# EAGLE design OttoPi04 (EAGLE 9.6.2)
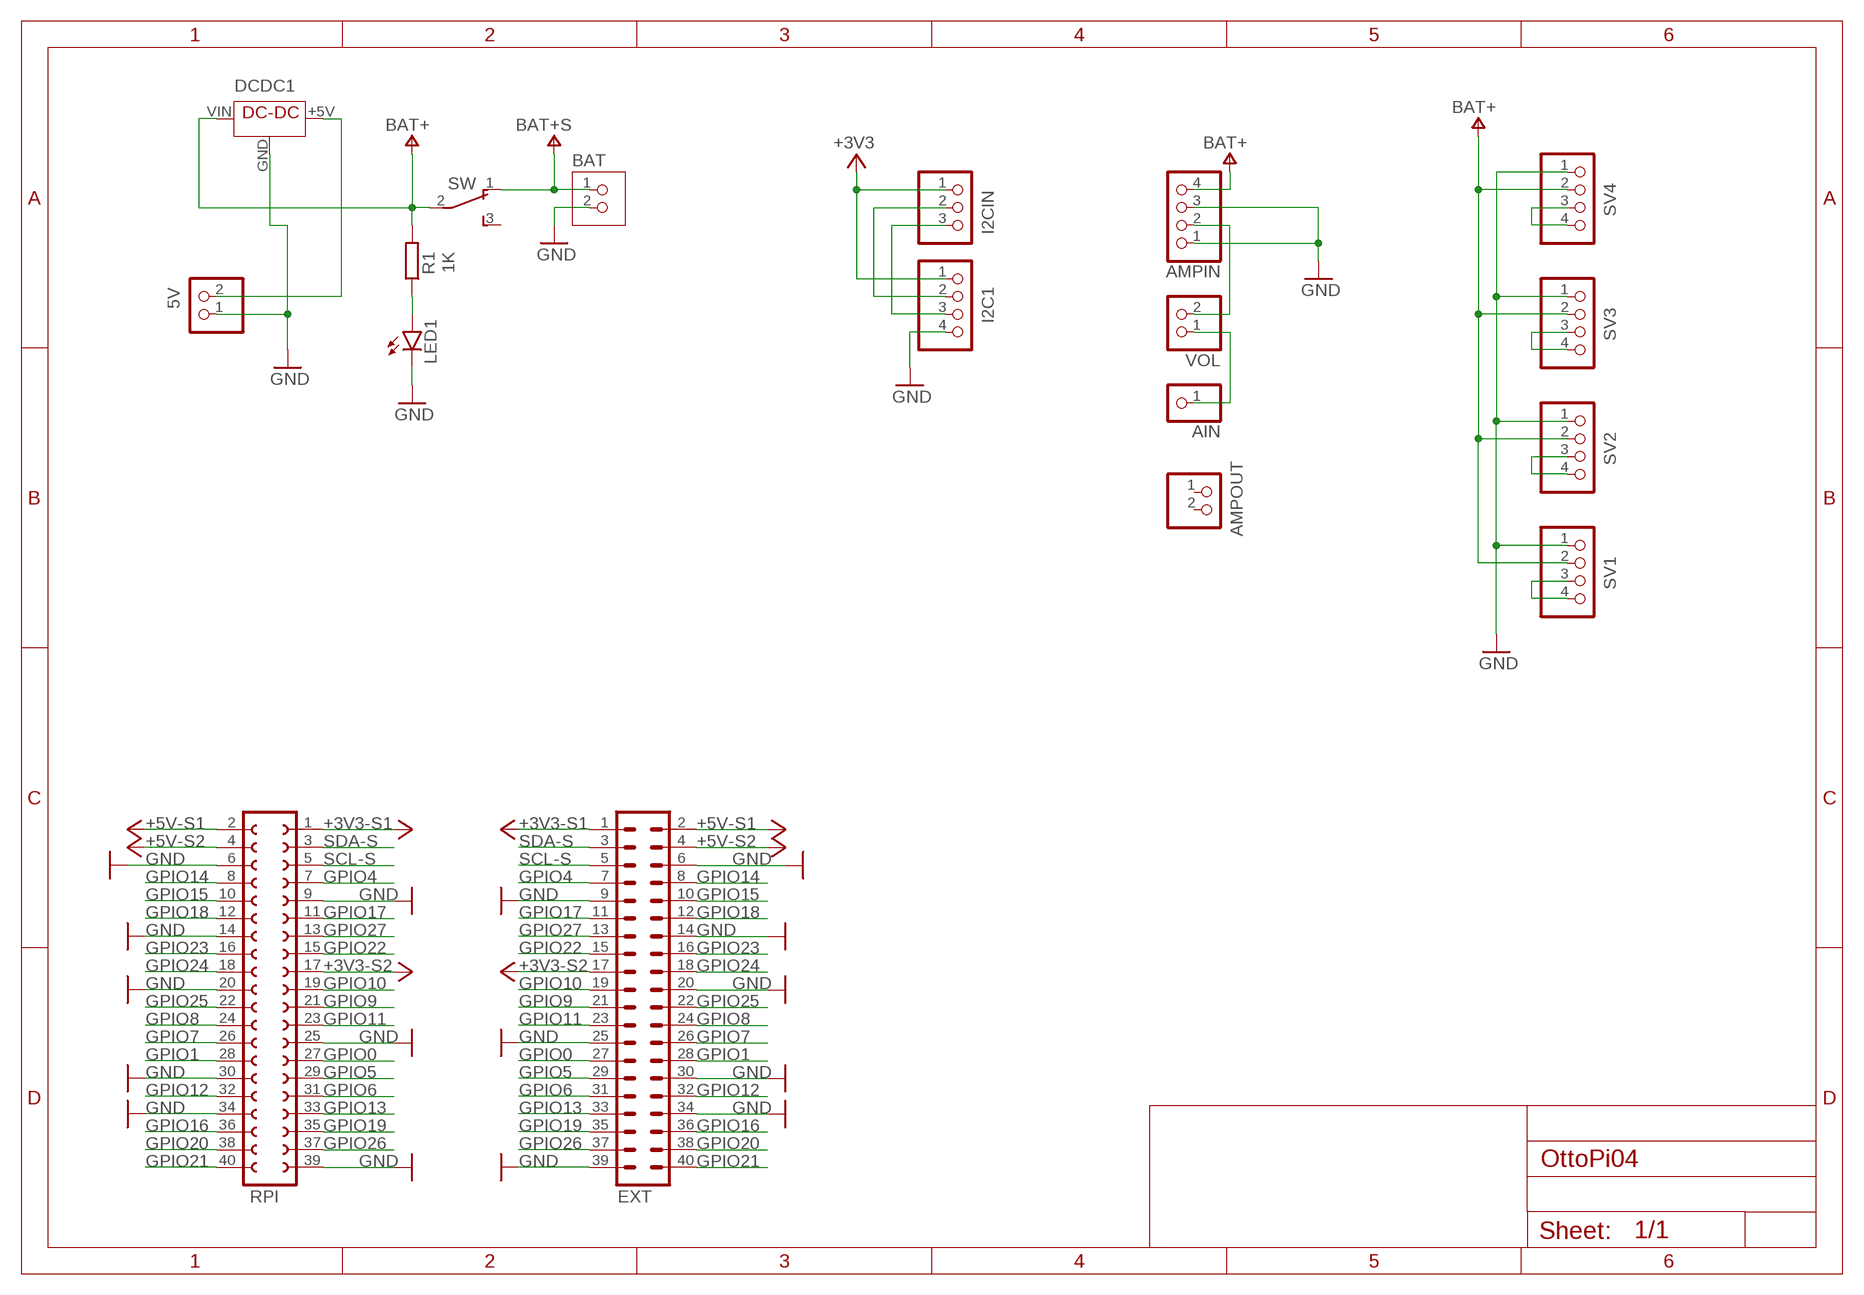
[diagram p0: schematic, sheet 1]

## Parts
5V  PINHD-1X2  [1X02]
AIN  PINHD-1X1  [1X01]
AMPIN  PINHD-1X4  [1X04]
AMPOUT  PINHD-1X2  [1X02]
BAT  JST-PH2  [JST-PH2]
DCDC1  DCDC-5V-0.48A  [DCDC-5V-0.48A]
EXT  MA20-2W  [MA20-2W]
I2C1  PINHD-1X4  [1X04]
I2CIN  PINHD-1X3  [1X03]
LED1  LED3MM  [LED3MM]
R1  1K  R-EU_0204/7  [0204/7]
RPI  FE20-2  [FE20-2]
SV1  PINHD-1X4  [1X04]
SV2  PINHD-1X4  [1X04]
SV3  PINHD-1X4  [1X04]
SV4  PINHD-1X4  [1X04]
SW  TL36PO  [TL3XPO]
VOL  PINHD-1X2  [1X02]

## Nets
+3V3: I2C1.1 I2CIN.1
+3V3-S1: EXT.1 RPI.1 ; supply symbol labelled +3V3
+3V3-S2: EXT.17 RPI.17 ; supply symbol labelled +3V3
+4V_S: BAT.1 SW.1(O) ; supply symbol labelled BAT+S
+5V: 5V.2 DCDC1.+5V(VOUT)
+5V-S1: EXT.2 RPI.2 ; supply symbol labelled +5V
+5V-S2: EXT.4 RPI.4 ; supply symbol labelled +5V
AIN1: AIN.1 VOL.1
AIN2: AMPIN.2 VOL.2
GND: 5V.1 AMPIN.1 AMPIN.3 BAT.2 DCDC1.GND EXT.6 EXT.9 EXT.14 EXT.20 EXT.25 EXT.30 EXT.34 EXT.39 I2C1.4 LED1.K(C) RPI.6 RPI.9 RPI.14 RPI.20 RPI.25 RPI.30 RPI.34 RPI.39 SV1.1 SV2.1 SV3.1 SV4.1
GPIO0: EXT.27 RPI.27
GPIO1: EXT.28 RPI.28
GPIO4: EXT.7 RPI.7
GPIO5: EXT.29 RPI.29
GPIO6: EXT.31 RPI.31
GPIO7: EXT.26 RPI.26
GPIO8: EXT.24 RPI.24
GPIO9: EXT.21 RPI.21
GPIO10: EXT.19 RPI.19
GPIO11: EXT.23 RPI.23
GPIO12: EXT.32 RPI.32
GPIO13: EXT.33 RPI.33
GPIO14: EXT.8 RPI.8
GPIO15: EXT.10 RPI.10
GPIO16: EXT.36 RPI.36
GPIO17: EXT.11 RPI.11
GPIO18: EXT.12 RPI.12
GPIO19: EXT.35 RPI.35
GPIO20: EXT.38 RPI.38
GPIO21: EXT.40 RPI.40
GPIO22: EXT.15 RPI.15
GPIO23: EXT.16 RPI.16
GPIO24: EXT.18 RPI.18
GPIO25: EXT.22 RPI.22
GPIO26: EXT.37 RPI.37
GPIO27: EXT.13 RPI.13
LED: LED1.A R1.1
SCL: I2C1.3 I2CIN.3
SCL-S: EXT.5 RPI.5
SDA-S: EXT.3 RPI.3
SDL: I2C1.2 I2CIN.2
SV1: SV1.3 SV1.4
SV2: SV2.3 SV2.4
SV3: SV3.3 SV3.4
SV4: SV4.3 SV4.4
V+: AMPIN.4 DCDC1.VIN R1.2 SV1.2 SV2.2 SV3.2 SV4.2 SW.2(P) ; supply symbol labelled BAT+
Unconnected: AMPOUT.1 AMPOUT.2 SW.3(S)

## Library data of the parts
5V AMPOUT VOL = pinhead:PINHD-1X2: PIN HEADER
AIN = pinhead:PINHD-1X1: PIN HEADER
AMPIN I2C1 SV1-SV4 = pinhead:PINHD-1X4: PIN HEADER
BAT = ytani1:JST-PH2
DCDC1 = ytani1:DCDC-5V-0.48A: DC-DC step up converter T64 https://www.amazon.co.jp/gp/product/B07N8TBJB3/ Vin: 0.9V-5V Vout: 5V; URL_AMAZON: https://www.amazon.co.jp/gp/product/B07N8TBJB3/
EXT = con-lstb:MA20-2W: PIN HEADER; OC_FARNELL: unknown; OC_NEWARK: unknown
I2CIN = pinhead:PINHD-1X3: PIN HEADER
LED1 = led:LED: LED OSRAM: - CHIPLED LG R971, LG N971, LY N971, LG Q971, LY Q971, LO R971, LY R971 LH N974, LH R974 LS Q976, LO Q976, LY Q976 LO Q996 - Hyper CHIPLED LW Q18S LB Q993, LB Q99A, LB R99A - SideLED LS A670, LO A670, LY A670, LG A670, LP A670 LB A673, LV A673, LT A673, LW A673 LH A674 LY A675 LS A676, LA A676, LO A676, LY A676, LW A676 LS A679, LY A679, LG A679 - Hyper Micro SIDELED® LS Y876, LA Y876, LO Y876, LY Y876 LT Y87S - SmartLED LW L88C, LW L88S LB L89C, LB L89S, LG L890 LS L89K, LO L89K, LY L89K LS L896, LA L896, LO L896, LY L896 - TOPLED LS T670, LO T670, LY T670, LG T670, LP T670 LSG T670, LSP T670, LSY T670, LOP T670, LYG T670 LG T671, LOG T671, LSG T671 LB T673, LV T673, LT T673, LW T673 LH T674 LS T676, LA T676, LO T676, LY T676, LB T676, LH T676, LSB T676, LW T676 LB T67C, LV T67C, LT T67C, LS T67K, LO T67K, LY T67K, LW E67C LS E67B, LA E67B, LO E67B, LY E67B, LB E67C, LV E67C, LT E67C LW T67C LS T679, LY T679, LG T679 LS T770, LO T770, LY T770, LG T770, LP T770 LB T773, LV T773, LT T773, LW T773 LH T774 LS E675, LA E675, LY E675, LS T675 LS T776, LA T776, LO T776, LY T776, LB T776 LHGB T686 LT T68C, LB T68C - Hyper Mini TOPLED® LB M676 - Mini TOPLED Santana® LG M470 LS M47K, LO M47K, LY M47K Source: http://www.osram.convergy.de LUXEON: - LUMILED® LXK2-PW12-R00, LXK2-PW12-S00, LXK2-PW14-U00, LXK2-PW14-V00 LXK2-PM12-R00, LXK2-PM12-S00, LXK2-PM14-U00 LXK2-PE12-Q00, LXK2-PE12-R00, LXK2-PE12-S00, LXK2-PE14-T00, LXK2-PE14-U00 LXK2-PB12-K00, LXK2-PB12-L00, LXK2-PB12-M00, LXK2-PB14-N00, LXK2-PB14-P00, LXK2-PB14-Q00 LXK2-PR12-L00, LXK2-PR12-M00, LXK2-PR14-Q00, LXK2-PR14-R00 LXK2-PD12-Q00, LXK2-PD12-R00, LXK2-PD12-S00 LXK2-PH12-R00, LXK2-PH12-S00 LXK2-PL12-P00, LXK2-PL12-Q00, LXK2-PL12-R00 Source: www.luxeon.com KINGBRIGHT: KA-3528ASYC Source: www.kingbright.com
R1 = rcl:R-EU_: RESISTOR, European symbol; SPICEPREFIX: R
RPI = con-lsta:FE20-2: FEMALE HEADER; OC_FARNELL: unknown; OC_NEWARK: unknown
SW = switch:TL36PO: TINY SWITCH ON - ON Source: http://www2.produktinfo.conrad.com/datenblaetter/700000-724999/705152-da-01-de-Subminiaturschalter_TL_36YO.pdf

## Net classes
0 default: clearance 0.254 mm
1 V+: width 0.1 mm

## Board
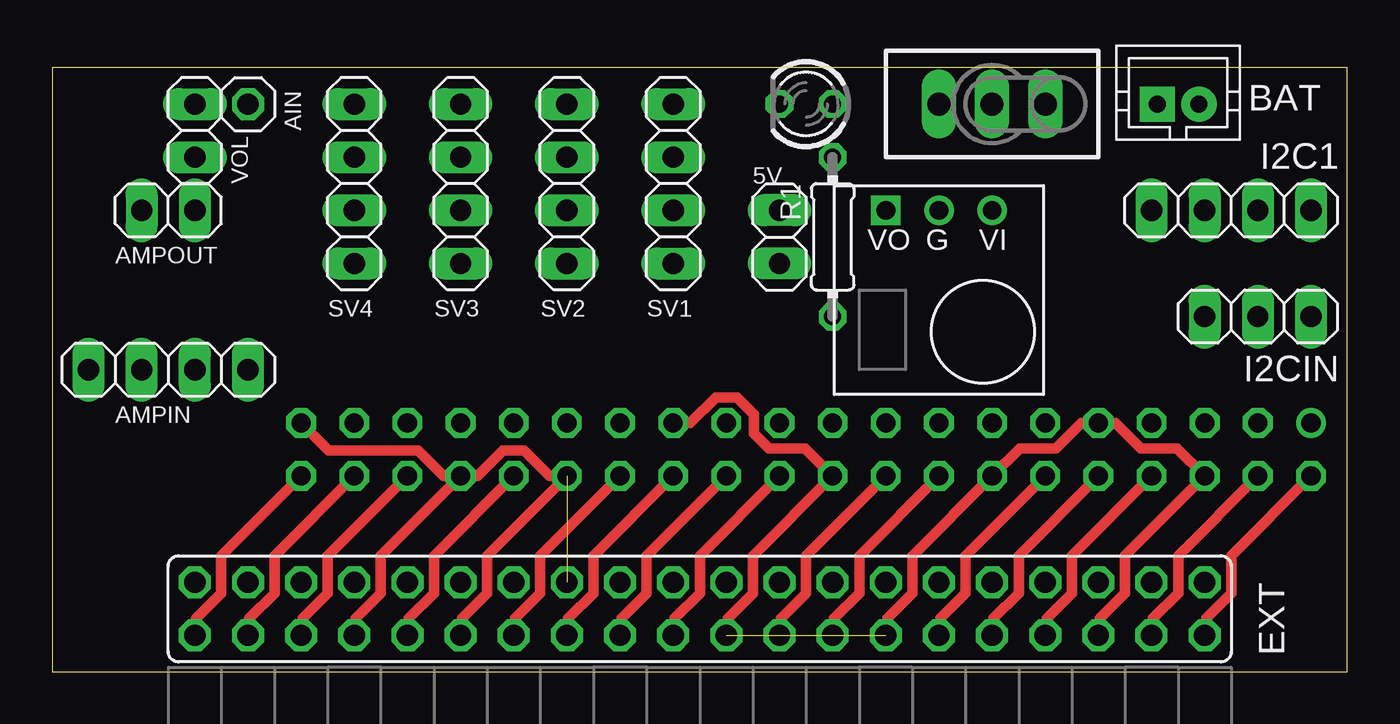
[diagram p1: board, top side]
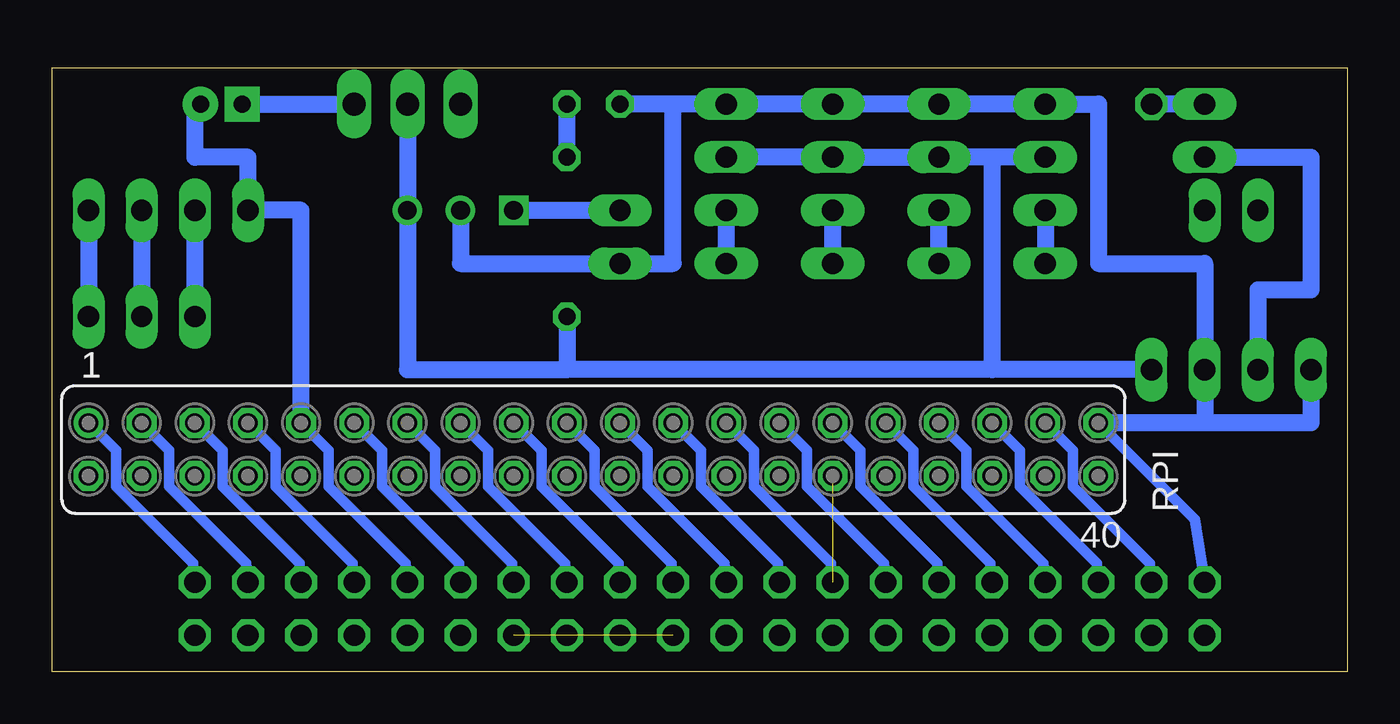
[diagram p2: board, bottom side, seen from below]

Size 61.88 x 28.86 mm. Coordinates in mm from the lower left corner, seen from the top.
Outline: 0,28.86 0,0 61.88,0 61.88,28.86 0,28.86
Copper layers (1*16): Top 0.035mm / dielectric 1.5mm / Bottom 0.035mm
Design rules "SeeedStudio_2layer_DRU_no_angle_20140221": minimum track width 6mil, minimum drill 12mil, track to track 6mil, track to pad 6mil, pad to pad 6mil, via to via 6mil, smd to smd 0mil, copper to edge 10mil, drill to drill 10mil, minimum pad ring 10mil, minimum via ring 6mil, stop-mask expansion 2mil, vias tented up to drill 100mil, thermal gap 10mil

### Footprints (pad centres in the part's own frame; a part is rotated, then mirrored left to right if it is on the bottom)
1X02 = drill 1.016 long: 1 -1.27,0; 2 1.27,0
1X01 = drill 1.016 octagon: 1 0,0
1X04 = drill 1.016 long: 1 -3.81,0; 2 -1.27,0; 3 1.27,0; 4 3.81,0
JST-PH2 = drill 0.813 pad 1.676 square: 1 -1,0 | drill 0.813 pad 1.676: 2 1,0
DCDC-5V-0.48A = drill 0.9 square: +5V -2.54,3.81 | drill 0.9: GND 0,3.81; VIN 2.54,3.81
MA20-2W = drill 1.016 octagon: 1 0,0; 2 0,2.54; 3 2.54,0; 4 2.54,2.54; 5 5.08,0; 6 5.08,2.54; 7 7.62,0; 8 7.62,2.54; 9 10.16,0; 10 10.16,2.54; 11 12.7,0; 12 12.7,2.54; 13 15.24,0; 14 15.24,2.54; 15 17.78,0; 16 17.78,2.54; 17 20.32,0; 18 20.32,2.54; 19 22.86,0; 20 22.86,2.54; 21 25.4,0; 22 25.4,2.54; 23 27.94,0; 24 27.94,2.54; 25 30.48,0; 26 30.48,2.54; 27 33.02,0; 28 33.02,2.54; 29 35.56,0; 30 35.56,2.54; 31 38.1,0; 32 38.1,2.54; 33 40.64,0; 34 40.64,2.54; 35 43.18,0; 36 43.18,2.54; 37 45.72,0; 38 45.72,2.54; 39 48.26,0; 40 48.26,2.54
1X03 = drill 1.016 long: 1 -2.54,0; 2 0,0; 3 2.54,0
LED3MM = drill 0.813 octagon: A -1.27,0; K 1.27,0
0204/7 = drill 0.813 octagon: 1 -3.81,0; 2 3.81,0
FE20-2 = drill 0.914: 1 -24.13,1.27 | drill 0.914 octagon: 2 -24.13,-1.27; 3 -21.59,1.27; 4 -21.59,-1.27; 5 -19.05,1.27; 6 -19.05,-1.27; 7 -16.51,1.27; 8 -16.51,-1.27; 9 -13.97,1.27; 10 -13.97,-1.27; 11 -11.43,1.27; 12 -11.43,-1.27; 13 -8.89,1.27; 14 -8.89,-1.27; 15 -6.35,1.27; 16 -6.35,-1.27; 17 -3.81,1.27; 18 -3.81,-1.27; 19 -1.27,1.27; 20 -1.27,-1.27; 21 1.27,1.27; 22 1.27,-1.27; 23 3.81,1.27; 24 3.81,-1.27; 25 6.35,1.27; 26 6.35,-1.27; 27 8.89,1.27; 28 8.89,-1.27; 29 11.43,1.27; 30 11.43,-1.27; 31 13.97,1.27; 32 13.97,-1.27; 33 16.51,1.27; 34 16.51,-1.27; 35 19.05,1.27; 36 19.05,-1.27; 37 21.59,1.27; 38 21.59,-1.27; 39 24.13,1.27; 40 24.13,-1.27
TL3XPO = drill 1.1 pad 1.422 long: 1 -2.54,0; 2 0,0; 3 2.54,0

### Placement (x,y rotation side)
5V  34.75,20.78 90 top
AIN  9.35,27.13 90 top
AMPIN  5.54,14.43 0 top
AMPOUT  5.54,22.05 180 top
BAT  53.8,27.13 0 top
DCDC1  42.37,18.24 0 top
EXT  55.07,4.27 180 top
I2C1  56.34,22.05 180 top
I2CIN  57.61,16.97 180 top
LED1  36.02,27.13 180 top
R1  37.29,20.78 270 top
RPI  36.02,10.62 0 bottom
SV1  29.67,23.32 270 top
SV2  24.59,23.32 270 top
SV3  19.51,23.32 270 top
SV4  14.43,23.32 270 top
SW  44.91,27.13 180 top
VOL  6.81,25.86 270 top

### Tracks (layer width: path | path; a pad name or v marks a point on that pad's centre or on a via)
+3V3
  Bottom 0.813: I2C1.1 I2CIN.1
+3V3-S1
  Bottom 0.508: RPI.1 58.83,10.57 58.83,8.84 55.15,5.16 EXT.1
+3V3-S2
  Bottom 0.508: RPI.17 38.51,10.57 38.51,8.84 34.83,5.16 EXT.17
+4V_S
  Bottom 0.813: BAT.1 SW.1
+5V
  Bottom 0.813: DCDC1.+5V 5V.2
+5V-S1
  Top 0.508: EXT.2 55.14,2.54 56.34,3.74 56.34,5.54 RPI.2
+5V-S2
  Top 0.508: EXT.4 52.6,2.54 53.8,3.74 53.8,5.54 RPI.4
AIN1
  Bottom 0.813: VOL.1 AIN.1
AIN2
  Bottom 0.813: VOL.2 1.73,24.59 1.73,18.24 4.27,18.24 AMPIN.2
GND  (2 unrouted)
  Top 0.508: EXT.34 14.5,2.54 15.7,3.74 15.7,5.54 RPI.34 | EXT.20 32.28,2.54 33.48,3.74 33.48,5.54 RPI.20 35.97,10.67 34.24,10.67 33.53,11.38 33.53,12.29 32.71,13.11 31.71,13.11 30.49,11.89 RPI.25 | EXT.14 39.9,2.54 41.1,3.74 41.1,5.54 RPI.14 46.23,10.67 47.95,10.67 49.17,11.89 RPI.9 50.81,11.89 52.02,10.67 53.75,10.67 RPI.6 51.26,5.54 51.26,3.74 50.06,2.54 EXT.6 | EXT.30 19.58,2.54 20.78,3.74 20.78,5.54 RPI.30 23.77,9.35 22.55,10.57 21.55,10.57 20.33,9.35 RPI.34 | RPI.34 18.69,9.35 17.48,10.57 13.21,10.57 RPI.39
  Bottom 0.508: EXT.39 7.29,7.29 RPI.39 | RPI.9 48.67,10.57 48.67,8.84 44.99,5.16 EXT.9 | RPI.25 28.35,10.57 28.35,8.84 24.67,5.16 EXT.25
  Bottom 0.813: AMPIN.1 1.73,11.89 6.81,11.89 | 6.81,11.89 RPI.39 | 6.81,11.89 AMPIN.3 6.81,19.51 11.89,19.51 11.89,27.13 SV4.1 SV3.1 SV2.1 SV1.1 32.21,27.13 | 32.21,27.13 LED1.K | RPI.9 49.99,22.05 I2C1.4 52.53,24.59 55.07,24.59 55.07,26.86 BAT.2 | 32.21,27.13 32.21,19.51 5V.1 42.37,19.51 DCDC1.GND
GPIO0
  Bottom 0.508: RPI.27 25.81,10.57 25.81,8.84 22.13,5.16 EXT.27
GPIO1
  Top 0.508: EXT.28 22.12,2.54 23.32,3.74 23.32,5.54 RPI.28
GPIO4
  Bottom 0.508: RPI.7 51.21,10.57 51.21,8.84 47.53,5.16 EXT.7
GPIO5
  Bottom 0.508: RPI.29 23.27,10.57 23.27,8.84 19.59,5.16 EXT.29
GPIO6
  Bottom 0.508: RPI.31 20.73,10.57 20.73,8.84 17.05,5.16 EXT.31
GPIO7
  Top 0.508: EXT.26 24.66,2.54 25.86,3.74 25.86,5.54 RPI.26
GPIO8
  Top 0.508: EXT.24 27.2,2.54 28.4,3.74 28.4,5.54 RPI.24
GPIO9
  Bottom 0.508: RPI.21 33.43,10.57 33.43,8.84 29.75,5.16 EXT.21
GPIO10
  Bottom 0.508: RPI.19 35.97,10.57 35.97,8.84 32.29,5.16 EXT.19
GPIO11
  Bottom 0.508: RPI.23 30.89,10.57 30.89,8.84 27.21,5.16 EXT.23
GPIO12
  Top 0.508: EXT.32 17.04,2.54 18.24,3.74 18.24,5.54 RPI.32
GPIO13
  Bottom 0.508: RPI.33 18.19,10.57 18.19,8.84 14.51,5.16 EXT.33
GPIO14
  Top 0.508: EXT.8 47.52,2.54 48.72,3.74 48.72,5.54 RPI.8
GPIO15
  Top 0.508: EXT.10 44.98,2.54 46.18,3.74 46.18,5.54 RPI.10
GPIO16
  Top 0.508: EXT.36 11.96,2.54 13.16,3.74 13.16,5.54 RPI.36
GPIO17
  Bottom 0.508: RPI.11 46.13,10.57 46.13,8.84 42.45,5.16 EXT.11
GPIO18
  Top 0.508: EXT.12 42.44,2.54 43.64,3.74 43.64,5.54 RPI.12
GPIO19
  Bottom 0.508: RPI.35 15.65,10.57 15.65,8.84 11.97,5.16 EXT.35
GPIO20
  Top 0.508: EXT.38 9.42,2.54 10.62,3.74 10.62,5.54 RPI.38
GPIO21
  Top 0.508: EXT.40 6.88,2.54 8.08,3.74 8.08,5.54 RPI.40
GPIO22
  Bottom 0.508: RPI.15 41.05,10.57 41.05,8.84 37.37,5.16 EXT.15
GPIO23
  Top 0.508: EXT.16 37.36,2.54 38.56,3.74 38.56,5.54 RPI.16
GPIO24
  Top 0.508: EXT.18 34.82,2.54 36.02,3.74 36.02,5.54 RPI.18
GPIO25
  Top 0.508: EXT.22 29.74,2.54 30.94,3.74 30.94,5.54 RPI.22
GPIO26
  Bottom 0.508: RPI.37 13.11,10.57 13.11,8.84 9.43,5.16 EXT.37
GPIO27
  Bottom 0.508: RPI.13 43.59,10.57 43.59,8.84 39.91,5.16 EXT.13
LED
  Bottom 0.813: R1.1 LED1.A
SCL
  Bottom 0.813: I2C1.3 I2CIN.3
SCL-S
  Bottom 0.508: RPI.5 53.75,10.57 53.75,8.84 50.07,5.16 EXT.5
SDA-S
  Bottom 0.508: RPI.3 56.29,10.57 56.29,8.84 52.61,5.16 EXT.3
SDL
  Bottom 0.813: I2C1.2 I2CIN.2
SV1
  Bottom 0.813: SV1.4 SV1.3
SV2
  Bottom 0.813: SV2.3 SV2.4
SV3
  Bottom 0.813: SV3.4 SV3.3
SV4
  Bottom 0.813: SV4.3 SV4.4
V+
  Bottom 0.813: SV4.2 16.97,24.59 | 16.97,24.59 SV3.2 SV2.2 SV1.2 | AMPIN.4 16.97,14.43 | 16.97,24.59 16.97,14.43 | 16.97,14.43 37.29,14.43 | 37.29,14.43 44.91,14.43 DCDC1.VIN SW.2 | R1.2 37.29,14.43